# EAGLE design ESP8266-CT-EVB (EAGLE 7.2.0)
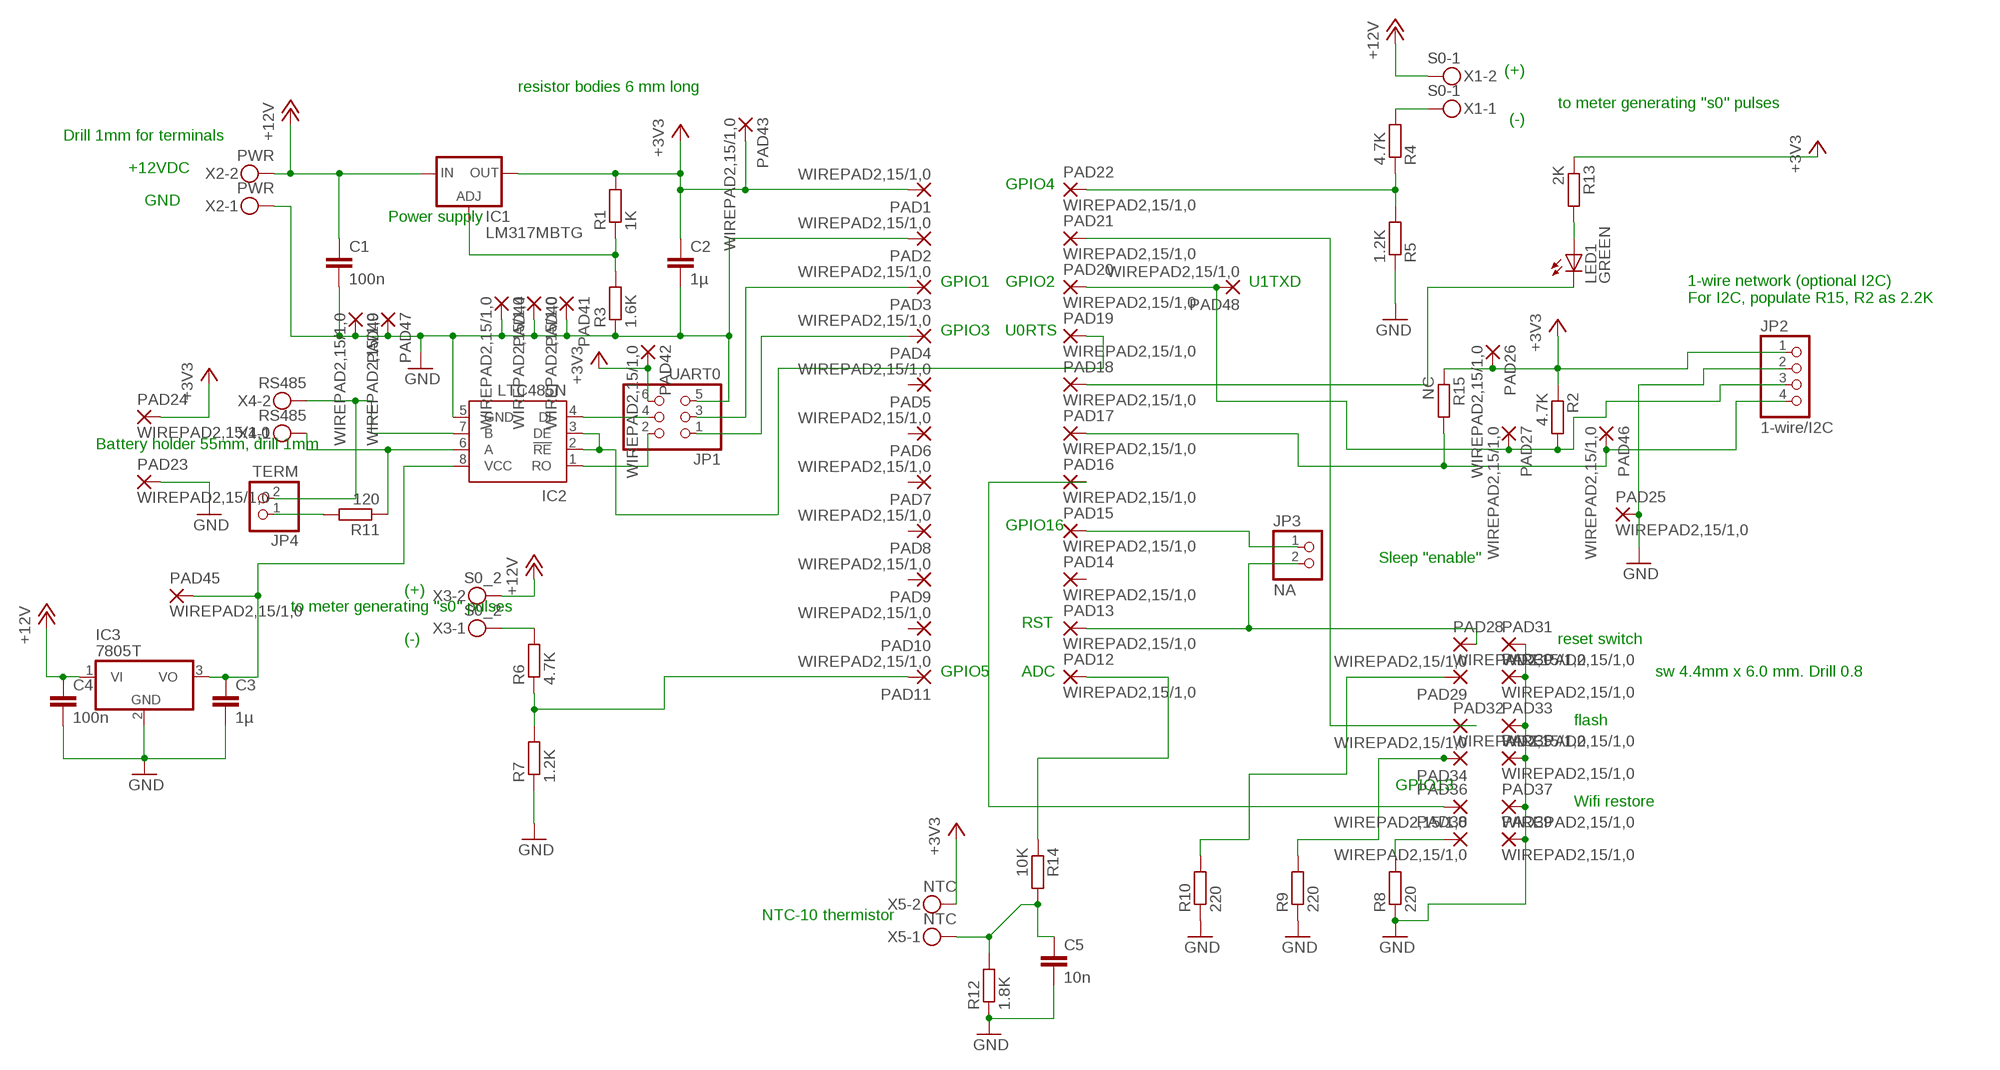
[diagram p0: schematic, sheet 1]

## Parts
C1  100n  C-EU050-024X044  [C050-024X044]
C2  1µ  C-EU050-024X044  [C050-024X044]
C3  1µ  C-EU050-024X044  [C050-024X044]
C4  100n  C-EU050-024X044  [C050-024X044]
C5  10n  C-EU050-024X044  [C050-024X044]
IC1  LM317MBTG  [TO220L1]
IC2  LTC485N  [DIL08]
IC3  7805T  [TO220H]
JP1  UART0  PINHD-2X3  [2X03]
JP2  1-wire/I2C  PINHD-1X4  [1X04]
JP3  NA  PINHD-1X2  [1X02]
JP4  TERM  PINHD-1X2  [1X02]
LED1  GREEN  LED3MM  [LED3MM]
PAD1  WIREPAD2,15/1,0  [2,15/1,0]
PAD2  WIREPAD2,15/1,0  [2,15/1,0]
PAD3  WIREPAD2,15/1,0  [2,15/1,0]
PAD4  WIREPAD2,15/1,0  [2,15/1,0]
PAD5  WIREPAD2,15/1,0  [2,15/1,0]
PAD6  WIREPAD2,15/1,0  [2,15/1,0]
PAD7  WIREPAD2,15/1,0  [2,15/1,0]
PAD8  WIREPAD2,15/1,0  [2,15/1,0]
PAD9  WIREPAD2,15/1,0  [2,15/1,0]
PAD10  WIREPAD2,15/1,0  [2,15/1,0]
PAD11  WIREPAD2,15/1,0  [2,15/1,0]
PAD12  WIREPAD2,15/1,0  [2,15/1,0]
PAD13  WIREPAD2,15/1,0  [2,15/1,0]
PAD14  WIREPAD2,15/1,0  [2,15/1,0]
PAD15  WIREPAD2,15/1,0  [2,15/1,0]
PAD16  WIREPAD2,15/1,0  [2,15/1,0]
PAD17  WIREPAD2,15/1,0  [2,15/1,0]
PAD18  WIREPAD2,15/1,0  [2,15/1,0]
PAD19  WIREPAD2,15/1,0  [2,15/1,0]
PAD20  WIREPAD2,15/1,0  [2,15/1,0]
PAD21  WIREPAD2,15/1,0  [2,15/1,0]
PAD22  WIREPAD2,15/1,0  [2,15/1,0]
PAD23  WIREPAD2,15/1,0  [2,15/1,0]
PAD24  WIREPAD2,15/1,0  [2,15/1,0]
PAD25  WIREPAD2,15/1,0  [2,15/1,0]
PAD26  WIREPAD2,15/1,0  [2,15/1,0]
PAD27  WIREPAD2,15/1,0  [2,15/1,0]
PAD28  WIREPAD2,15/1,0  [2,15/1,0]
PAD29  WIREPAD2,15/1,0  [2,15/1,0]
PAD30  WIREPAD2,15/1,0  [2,15/1,0]
PAD31  WIREPAD2,15/1,0  [2,15/1,0]
PAD32  WIREPAD2,15/1,0  [2,15/1,0]
PAD33  WIREPAD2,15/1,0  [2,15/1,0]
PAD34  WIREPAD2,15/1,0  [2,15/1,0]
PAD35  WIREPAD2,15/1,0  [2,15/1,0]
PAD36  WIREPAD2,15/1,0  [2,15/1,0]
PAD37  WIREPAD2,15/1,0  [2,15/1,0]
PAD38  WIREPAD2,15/1,0  [2,15/1,0]
PAD39  WIREPAD2,15/1,0  [2,15/1,0]
PAD40  WIREPAD2,15/1,0  [2,15/1,0]
PAD41  WIREPAD2,15/1,0  [2,15/1,0]
PAD42  WIREPAD2,15/1,0  [2,15/1,0]
PAD43  WIREPAD2,15/1,0  [2,15/1,0]
PAD44  WIREPAD2,15/1,0  [2,15/1,0]
PAD45  WIREPAD2,15/1,0  [2,15/1,0]
PAD46  WIREPAD2,15/1,0  [2,15/1,0]
PAD47  WIREPAD2,15/1,0  [2,15/1,0]
PAD48  WIREPAD2,15/1,0  [2,15/1,0]
PAD49  WIREPAD2,15/1,0  [2,15/1,0]
R1  1K  R-EU_0207/10  [0207/10]
R2  4.7K  R-EU_0207/2V  [0207/2V]
R3  1.6K  R-EU_0207/10  [0207/10]
R4  4.7K  R-EU_0207/10  [0207/10]
R5  1.2K  R-EU_0207/10  [0207/10]
R6  4.7K  R-EU_0207/10  [0207/10]
R7  1.2K  R-EU_0207/10  [0207/10]
R8  220  R-EU_0207/2V  [0207/2V]
R9  220  R-EU_0207/2V  [0207/2V]
R10  220  R-EU_0207/2V  [0207/2V]
R11  120  R-EU_0207/2V  [0207/2V]
R12  1.8K  R-EU_0207/10  [0207/10]
R13  2K  R-EU_0207/7  [0207/7]
R14  10K  R-EU_0207/2V  [0207/2V]
R15  NC  R-EU_0207/2V  [0207/2V]
X1  S0-1  MKDSN1,5/2-5,08  [MKDSN1,5/2-5,08]
X2  PWR  MKDSN1,5/2-5,08  [MKDSN1,5/2-5,08]
X3  S0_2  MKDSN1,5/2-5,08  [MKDSN1,5/2-5,08]
X4  RS485  MKDSN1,5/2-5,08  [MKDSN1,5/2-5,08]
X5  NTC  MKDSN1,5/2-5,08  [MKDSN1,5/2-5,08]

## Nets
+3V3: C2.1 IC1.2(OUT) JP1.6 JP2.1 PAD1.1(P) PAD24.1(P) PAD26.1(P) PAD42.1(P) PAD43.1(P) R1.2 R2.1 R13.1 R15.1 X5.2
+12V: C1.1 C4.1 IC1.3(IN) IC3.1(VI) X1.2 X2.2 X3.2
DQ: JP2.3 PAD20.1(P) PAD27.1(P) PAD48.1(P) R2.2
GND: C1.2 C2.2 C3.2 C4.2 C5.2 IC2.5(GND) IC3.2(GND) JP1.5 JP2.2 PAD2.1(P) PAD23.1(P) PAD25.1(P) PAD30.1(P) PAD31.1(P) PAD33.1(P) PAD35.1(P) PAD37.1(P) PAD39.1(P) PAD40.1(P) PAD41.1(P) PAD44.1(P) PAD47.1(P) PAD49.1(P) R3.1 R5.1 R7.1 R8.1 R9.1 R10.1 R12.1 X2.1
N$1: R6.2 X3.1
N$2: R4.2 X1.1
N$3: IC1.1(ADJ) R1.1 R3.2
N$4: PAD11.1(P) R6.1 R7.2
N$5: PAD38.1(P) R8.2
N$6: PAD22.1(P) R4.1 R5.2
N$7: LED1.A R13.2
N$9: PAD21.1(P) PAD32.1(P)
N$10: JP3.2 PAD13.1(P) PAD28.1(P)
N$11: LED1.K(C) PAD18.1(P)
N$12: JP2.4 PAD17.1(P) PAD46.1(P) R15.2
N$13: JP3.1 PAD15.1(P)
N$14: PAD34.1(P) R9.2
N$15: PAD29.1(P) R10.2
N$16: C3.1 IC2.8(VCC) IC3.3(VO) PAD45.1(P)
N$17: IC2.7(B) JP4.2 X4.2
N$18: IC2.6(A) R11.1 X4.1
N$19: JP4.1 R11.2
N$20: JP1.3 PAD3.1(P)
N$21: JP1.1 PAD4.1(P)
N$22: PAD12.1(P) R14.1
N$23: IC2.2(!RE) IC2.3(DE) PAD19.1(P)
N$24: C5.1 R12.2 R14.2 X5.1
N$26: PAD16.1(P) PAD36.1(P)
N$28: IC2.1(RO) JP1.2
N$29: IC2.4(DI) JP1.4
Unconnected: PAD5.1(P) PAD6.1(P) PAD7.1(P) PAD8.1(P) PAD9.1(P) PAD10.1(P) PAD14.1(P)

## Notes on the sheet
- (+)
- resistor bodies 6 mm long
- to meter generating "s0" pulses
- (-)
- Drill 1mm for terminals
- +12VDC
- GPIO4
- GND
- Power supply
- GPIO1 | GPIO2 | U1TXD
- 1-wire network (optional I2C)
  For I2C, populate R15, R2 as 2.2K
- GPIO3 | U0RTS
- Battery holder 55mm, drill 1mm
- GPIO16
- Sleep "enable"
- (+)
- to meter generating "s0" pulses
- RST
- (-) | reset switch
- GPIO5 | ADC | sw 4.4mm x 6.0 mm. Drill 0.8
- flash
- GPIO13
- Wifi restore
- NTC-10 thermistor

## Library data of the parts
C1-C5 = rcl:C-EU: CAPACITOR, European symbol
IC1 = v-reg:LM317?*: 500 mA Adjustable Output Positive Voltage Regulator Source: http://www.onsemi.co.jp .. LM317M-D.PDF
IC2 = linear-technology:LTC485: Low Power RS485 Interface Transceiver Source: http://www.linear.com/pc/downloadDocument.do?navId=H0,C1,C1007,C1017,P2064,D1718; OC_FARNELL: unknown; OC_NEWARK: unknown
IC3 = linear:78*: Positive VOLTAGE REGULATOR Source: http://cache.national.com/ds/LM/LM78L05.pdf http://www.fairchildsemi.com/ds/LM/LM7805.pdf
JP1 = pinhead:PINHD-2X3: PIN HEADER
JP2 = pinhead:PINHD-1X4: PIN HEADER
JP3 JP4 = pinhead:PINHD-1X2: PIN HEADER
LED1 = led:LED: LED OSRAM: - CHIPLED LG R971, LG N971, LY N971, LG Q971, LY Q971, LO R971, LY R971 LH N974, LH R974 LS Q976, LO Q976, LY Q976 LO Q996 - Hyper CHIPLED LW Q18S LB Q993, LB Q99A, LB R99A - SideLED LS A670, LO A670, LY A670, LG A670, LP A670 LB A673, LV A673, LT A673, LW A673 LH A674 LY A675 LS A676, LA A676, LO A676, LY A676, LW A676 LS A679, LY A679, LG A679 - Hyper Micro SIDELED® LS Y876, LA Y876, LO Y876, LY Y876 LT Y87S - SmartLED LW L88C, LW L88S LB L89C, LB L89S, LG L890 LS L89K, LO L89K, LY L89K LS L896, LA L896, LO L896, LY L896 - TOPLED LS T670, LO T670, LY T670, LG T670, LP T670 LSG T670, LSP T670, LSY T670, LOP T670, LYG T670 LG T671, LOG T671, LSG T671 LB T673, LV T673, LT T673, LW T673 LH T674 LS T676, LA T676, LO T676, LY T676, LB T676, LH T676, LSB T676, LW T676 LB T67C, LV T67C, LT T67C, LS T67K, LO T67K, LY T67K, LW E67C LS E67B, LA E67B, LO E67B, LY E67B, LB E67C, LV E67C, LT E67C LW T67C LS T679, LY T679, LG T679 LS T770, LO T770, LY T770, LG T770, LP T770 LB T773, LV T773, LT T773, LW T773 LH T774 LS E675, LA E675, LY E675, LS T675 LS T776, LA T776, LO T776, LY T776, LB T776 LHGB T686 LT T68C, LB T68C - Hyper Mini TOPLED® LB M676 - Mini TOPLED Santana® LG M470 LS M47K, LO M47K, LY M47K Source: http://www.osram.convergy.de LUXEON: - LUMILED® LXK2-PW12-R00, LXK2-PW12-S00, LXK2-PW14-U00, LXK2-PW14-V00 LXK2-PM12-R00, LXK2-PM12-S00, LXK2-PM14-U00 LXK2-PE12-Q00, LXK2-PE12-R00, LXK2-PE12-S00, LXK2-PE14-T00, LXK2-PE14-U00 LXK2-PB12-K00, LXK2-PB12-L00, LXK2-PB12-M00, LXK2-PB14-N00, LXK2-PB14-P00, LXK2-PB14-Q00 LXK2-PR12-L00, LXK2-PR12-M00, LXK2-PR14-Q00, LXK2-PR14-R00 LXK2-PD12-Q00, LXK2-PD12-R00, LXK2-PD12-S00 LXK2-PH12-R00, LXK2-PH12-S00 LXK2-PL12-P00, LXK2-PL12-Q00, LXK2-PL12-R00 Source: www.luxeon.com KINGBRIGHT: KA-3528ASYC Source: www.kingbright.com
PAD1-PAD49 = wirepad:WIREPAD: Wire PAD connect wire on PCB
R1 R3-R7 R12 = resistor:R-EU_: RESISTOR, European symbol
R2 R8-R11 R13-R15 = rcl:R-EU_: RESISTOR, European symbol
X1-X5 = con-phoenix-508:MKDSN1,5/2-5,08: MKDSN 1,5/ 2-5,08 Printklemme Nennstrom: 13,5 A Nennspannung: 250 V Rastermaß: 5,08 mm Polzahl: 2 Anschlussart: Schraubanschluss Montage: Löten Anschlussrichtung Leiter/Platine: 0 ° Artikelnummer: 1729128 Source: http://eshop.phoenixcontact.com .. 1729128.pdf

## Board
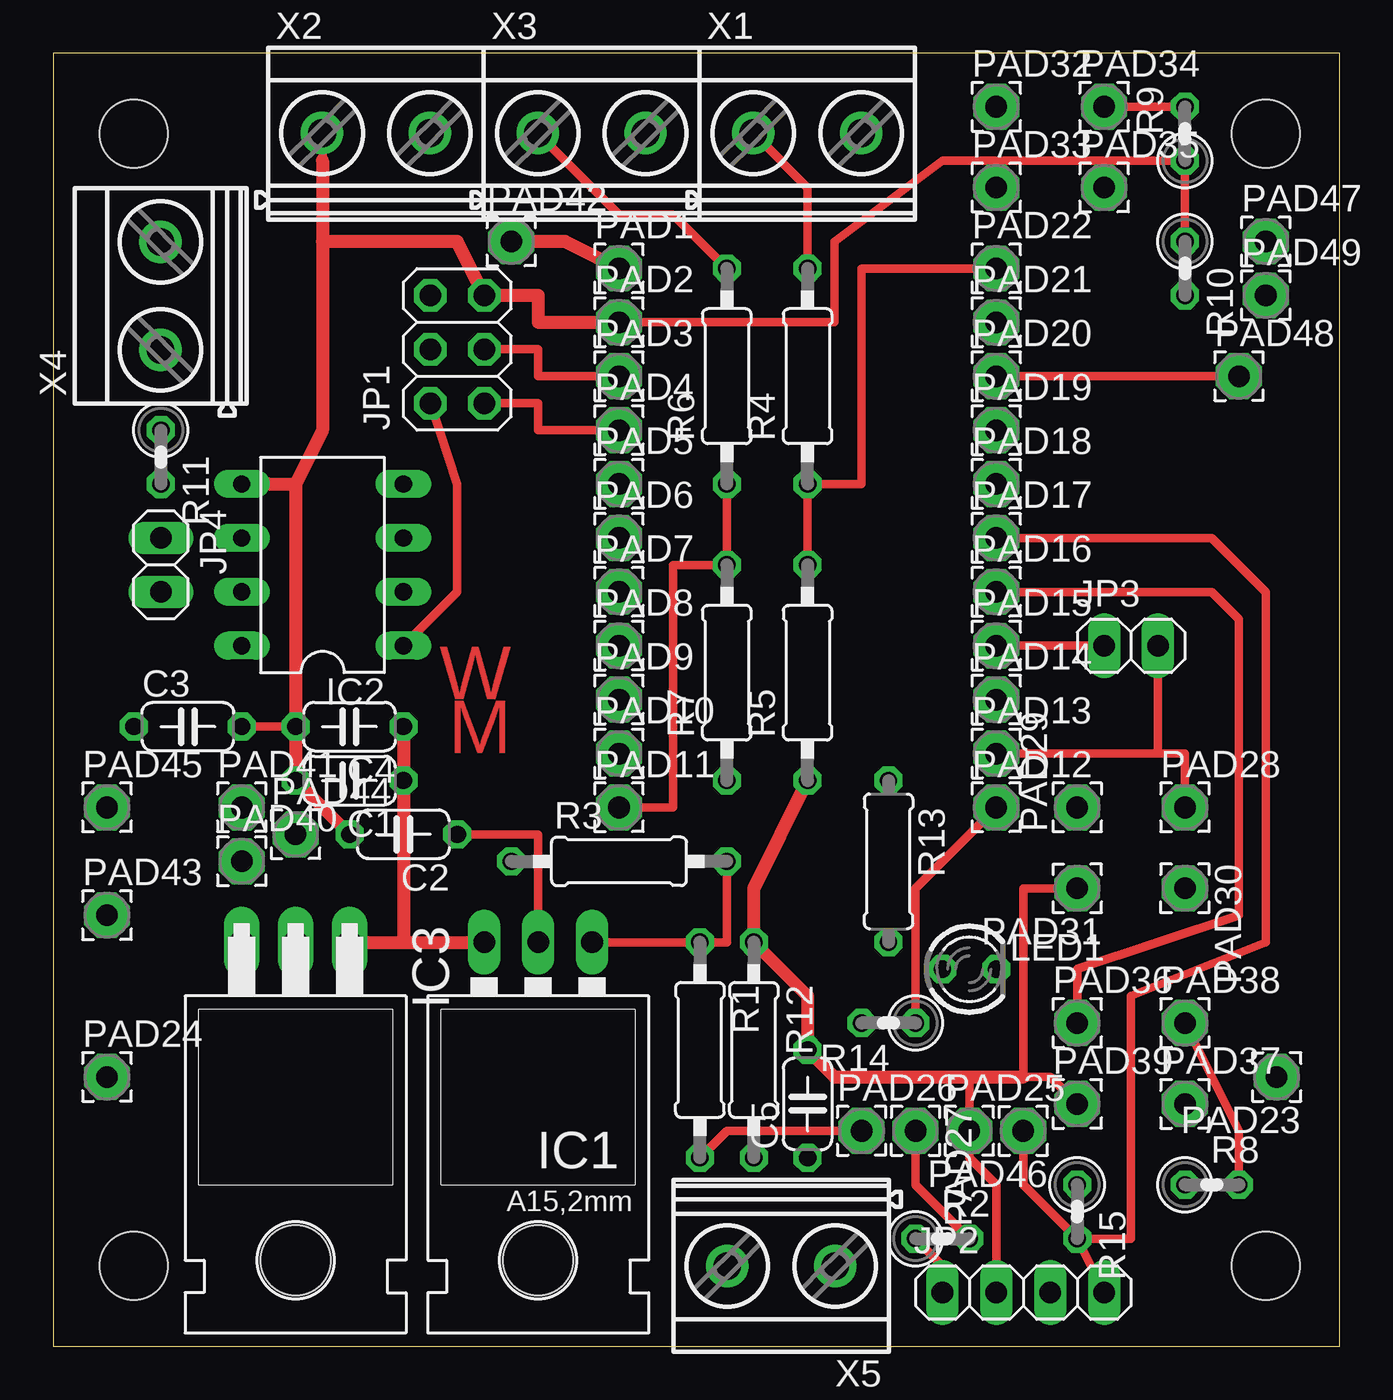
[diagram p1: board, top side]
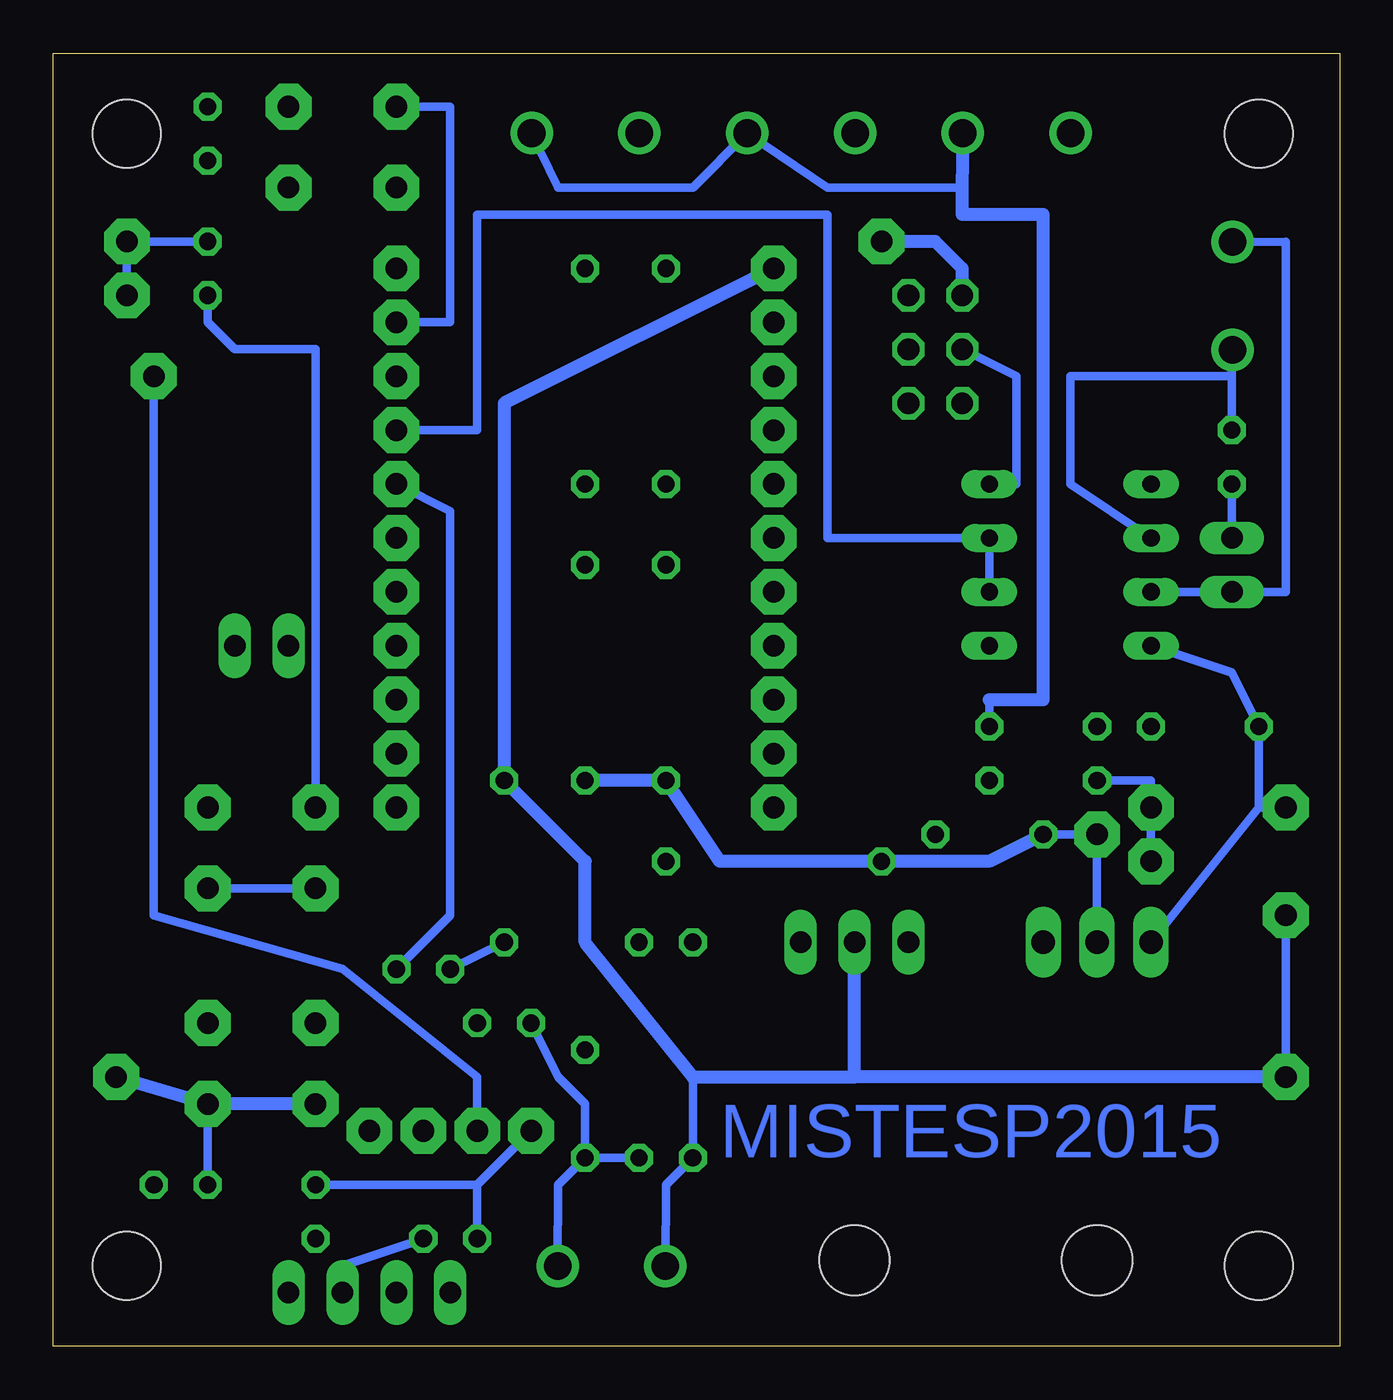
[diagram p2: board, bottom side, seen from below]

Size 60.63 x 60.95 mm. Coordinates in mm from the lower left corner, seen from the top.
Outline: 0,0 60.63,0 60.63,60.95 0,60.95 0,0
Copper layers (1*16): Top 0.035mm / dielectric 1.5mm / Bottom 0.035mm
Design rules "default *": minimum track width 7mil, minimum drill 24mil, track to track 12mil, track to pad 12mil, pad to pad 12mil, via to via 12mil, smd to smd 12mil, copper to edge 40mil, drill to drill 8mil, minimum pad ring 10mil, minimum via ring 8mil, stop-mask expansion 4mil, vias tented up to drill 0mil, thermal gap 10mil
Holes 3.2 mm at 3.81,57.15 3.81,3.81 57.15,3.81 57.15,57.15

### Footprints (pad centres in the part's own frame; a part is rotated, then mirrored left to right if it is on the bottom)
C050-024X044 = drill 0.813 octagon: 1 -2.54,0; 2 2.54,0
TO220L1 = drill 1.016 long: 1 -2.54,-3.81; 2 0,-3.81; 3 2.54,-3.81 | hole 3.302: 0,11.176
DIL08 = drill 0.813 long: 1 -3.81,-3.81; 2 -1.27,-3.81; 3 1.27,-3.81; 4 3.81,-3.81; 5 3.81,3.81; 6 1.27,3.81; 7 -1.27,3.81; 8 -3.81,3.81
TO220H = drill 1.118 long: 1 -2.54,-10.16; 2 0,-10.16; 3 2.54,-10.16 | hole 3.302: 0,4.826
2X03 = drill 1.016 octagon: 1 -2.54,-1.27; 2 -2.54,1.27; 3 0,-1.27; 4 0,1.27; 5 2.54,-1.27; 6 2.54,1.27
1X04 = drill 1.016 long: 1 -3.81,0; 2 -1.27,0; 3 1.27,0; 4 3.81,0
1X02 = drill 1.016 long: 1 -1.27,0; 2 1.27,0
LED3MM = drill 0.813 octagon: A -1.27,0; K 1.27,0
2,15/1,0 = drill 1.016 pad 2.159 octagon: 1 0,0
0207/10 = drill 0.813 octagon: 1 -5.08,0; 2 5.08,0
0207/2V = drill 0.813 octagon: 1 -1.27,0; 2 1.27,0
0207/7 = drill 0.813 octagon: 1 -3.81,0; 2 3.81,0
MKDSN1,5/2-5,08 = drill 1.3 pad 2: 1 -2.561,0.025; 2 2.519,0.025

### Placement (x,y rotation side)
C1  13.97,26.67 180 top
C2  16.51,24.13 180 top
C3  6.35,29.21 0 top
C4  13.97,29.21 180 top
C5  35.56,11.43 90 top
IC1  22.86,15.24 180 top
IC2  12.7,36.83 90 top
IC3  11.43,8.89 180 top
JP1  19.05,46.99 90 top
JP2  45.72,2.54 0 top
JP3  50.8,33.02 0 top
JP4  5.08,36.83 270 top
LED1  43.18,17.78 0 top
PAD1  26.67,50.8 0 top
PAD2  26.67,48.26 0 top
PAD3  26.67,45.72 0 top
PAD4  26.67,43.18 0 top
PAD5  26.67,40.64 0 top
PAD6  26.67,38.1 0 top
PAD7  26.67,35.56 0 top
PAD8  26.67,33.02 0 top
PAD9  26.67,30.48 0 top
PAD10  26.67,27.94 0 top
PAD11  26.67,25.4 0 top
PAD12  44.45,25.4 0 top
PAD13  44.45,27.94 0 top
PAD14  44.45,30.48 0 top
PAD15  44.45,33.02 0 top
PAD16  44.45,35.56 0 top
PAD17  44.45,38.1 0 top
PAD18  44.45,40.64 0 top
PAD19  44.45,43.18 0 top
PAD20  44.45,45.72 0 top
PAD21  44.45,48.26 0 top
PAD22  44.45,50.8 0 top
PAD23  57.66,12.7 180 top
PAD24  2.54,12.7 0 top
PAD25  43.18,10.16 0 top
PAD26  38.1,10.16 0 top
PAD27  40.64,10.16 270 top
PAD28  53.34,25.4 0 top
PAD29  48.26,25.4 90 top
PAD30  53.34,21.59 270 top
PAD31  48.26,21.59 180 top
PAD32  44.45,58.42 0 top
PAD33  44.45,54.61 0 top
PAD34  49.53,58.42 0 top
PAD35  49.53,54.61 0 top
PAD36  48.26,15.24 0 top
PAD37  53.34,11.43 0 top
PAD38  53.34,15.24 0 top
PAD39  48.26,11.43 0 top
PAD40  8.89,22.86 0 top
PAD41  8.89,25.4 0 top
PAD42  21.59,52.07 0 top
PAD43  2.54,20.32 0 top
PAD44  11.43,24.13 0 top
PAD45  2.54,25.4 0 top
PAD46  45.72,10.16 180 top
PAD47  57.15,52.07 0 top
PAD48  55.88,45.72 0 top
PAD49  57.15,49.53 0 top
R1  30.48,13.97 270 top
R2  41.91,5.08 0 top
R3  26.67,22.86 0 top
R4  35.56,45.72 90 top
R5  35.56,31.75 90 top
R6  31.75,45.72 90 top
R7  31.75,31.75 90 top
R8  54.61,7.62 0 top
R9  53.34,57.15 90 top
R10  53.34,50.8 270 top
R11  5.08,41.91 270 top
R12  33.02,13.97 270 top
R13  39.37,22.86 270 top
R14  39.37,15.24 180 top
R15  48.26,6.35 270 top
X1  35.56,57.15 0 top
X2  15.24,57.15 0 top
X3  25.4,57.15 0 top
X4  5.08,49.53 90 top
X5  34.29,3.81 180 top

### Tracks (layer width: path | path; a pad name or v marks a point on that pad's centre or on a via)
+3V3
  Top 0.406: C2.1 22.86,24.13 IC1.2 | R1.2 31.75,10.16 PAD26.1 | R2.1 41.91,3.81 JP2.1
  Top 0.61: PAD1.1 24.13,52.07 PAD42.1
  Bottom 0.406: 30.48,12.7 R1.2 31.75,7.62 X5.2 | PAD26.1 40.64,7.62 | 40.64,7.62 R2.1 | R15.1 40.64,7.62 | PAD43.1 PAD24.1
  Bottom 0.61: 22.86,12.7 30.48,12.7 35.56,19.05 35.56,22.86 R13.1 39.37,44.45 PAD1.1 | 22.86,12.7 IC1.2 | PAD24.1 22.86,12.7 | JP1.6 17.78,50.8 19.05,52.07 PAD42.1
+12V
  Top 0.61: C4.1 C1.1 16.51,19.05 | IC3.1 16.51,19.05 | 16.51,19.05 IC1.3
  Bottom 0.406: C4.1 16.51,30.48 | X2.2 17.78,54.61 24.13,54.61 X3.2 30.48,54.61 36.83,54.61 X1.2
  Bottom 0.61: 16.51,30.48 13.97,30.48 13.97,53.34 17.78,53.34 X2.2
DQ
  Top 0.406: PAD20.1 PAD48.1 | PAD27.1 40.64,7.62 R2.2
  Bottom 0.406: R2.2 46.99,3.81 JP2.3 | PAD48.1 55.88,20.32 46.99,17.78 40.64,12.7 PAD27.1
GND
  Top 0.406: X2.1 12.7,55.88 | PAD2.1 36.83,48.26 36.83,52.07 41.91,55.88 44.45,55.88 | 44.45,55.88 49.53,55.88 | R10.1 R9.1 49.53,55.88 | PAD33.1 44.45,55.88 | PAD35.1 49.53,55.88 | IC2.5 10.16,40.64 | C4.2 C3.2 | JP2.2 44.45,7.62 43.18,8.89 PAD25.1 43.18,12.7 | PAD39.1 46.99,12.7 45.72,12.7 45.72,21.59 PAD31.1
  Top 0.61: 12.7,55.88 12.7,52.07 | 12.7,52.07 12.7,43.18 11.43,40.64 | 10.16,40.64 11.43,40.64 | C2.2 C1.2 C4.2 11.43,40.64 | 12.7,52.07 19.05,52.07 JP1.5 22.86,49.53 22.86,48.26 PAD2.1 | R5.1 33.02,21.59 R12.1 35.56,16.51 C5.2 36.83,12.7 43.18,12.7 45.72,12.7
  Bottom 0.406: IC3.2 PAD44.1 C2.2 | PAD31.1 PAD30.1 | PAD37.1 R8.1 | PAD40.1 PAD41.1 8.89,26.67 C1.2 | R10.1 PAD47.1 PAD49.1
  Bottom 0.61: PAD23.1 PAD37.1 PAD39.1 | C2.2 16.51,22.86 R3.1 29.21,22.86 R7.1 R5.1
N$1
  Top 0.406: X3.1 26.67,53.34 29.21,53.34 R6.2
N$2
  Top 0.406: X1.1 35.56,54.61 R4.2
N$3
  Top 0.406: IC1.1 R1.1 31.75,19.05 31.75,20.32 31.75,21.59 R3.2
N$4
  Top 0.406: R6.1 R7.2 29.21,36.83 29.21,25.4 PAD11.1
N$5
  Top 0.406: PAD38.1 55.88,10.16 R8.2
N$6
  Top 0.406: R5.2 R4.1 38.1,40.64 38.1,50.8 PAD22.1
N$7
  Bottom 0.406: R13.2 LED1.A
N$9
  Bottom 0.406: PAD21.1 41.91,48.26 41.91,58.42 PAD32.1
N$10
  Top 0.406: PAD13.1 52.07,27.94 | 52.07,27.94 53.34,27.94 PAD28.1 | JP3.2 52.07,27.94
N$11
  Bottom 0.406: LED1.K 41.91,20.32 41.91,39.37 PAD18.1
N$12
  Top 0.406: R15.2 JP2.4 | R15.2 45.72,7.62 PAD46.1 | PAD17.1 54.61,38.1 57.15,35.56 57.15,19.05 50.8,16.51 50.8,5.08 R15.2
N$13
  Top 0.406: PAD15.1 JP3.1
N$14
  Top 0.406: PAD34.1 R9.2
N$15
  Bottom 0.406: R10.2 53.34,48.26 52.07,46.99 48.26,46.99 PAD29.1
N$16
  Bottom 0.406: IC2.8 5.08,31.75 C3.1 3.81,25.4 | 3.81,25.4 IC3.3 | PAD45.1 3.81,25.4
N$17
  Bottom 0.406: JP4.2 IC2.7 2.54,35.56 2.54,52.07 X4.2
N$18
  Bottom 0.406: X4.1 5.08,45.72 | 5.08,45.72 R11.1 | IC2.6 12.7,40.64 12.7,45.72 5.08,45.72
N$19
  Bottom 0.406: R11.2 JP4.1
N$20
  Top 0.406: JP1.3 22.86,46.99 22.86,45.72 PAD3.1
N$21
  Top 0.406: JP1.1 22.86,44.45 22.86,43.18 PAD4.1
N$22
  Top 0.406: R14.1 40.64,21.59 PAD12.1
N$23
  Bottom 0.406: IC2.2 IC2.3 24.13,38.1 24.13,53.34 40.64,53.34 40.64,43.18 PAD19.1
N$24
  Bottom 0.406: C5.1 35.56,11.43 36.83,12.7 R14.2 | R12.2 C5.1 | X5.1 36.83,7.62 C5.1
N$26
  Top 0.406: PAD16.1 54.61,35.56 55.88,34.29 55.88,20.32 48.26,17.78 PAD36.1
N$28
  Top 0.406: JP1.2 19.05,40.64 19.05,35.56 IC2.1
N$29
  Bottom 0.406: IC2.4 15.24,40.64 15.24,45.72 JP1.4

### Text on the board
Top: W | M
Bottom: MISTESP2015